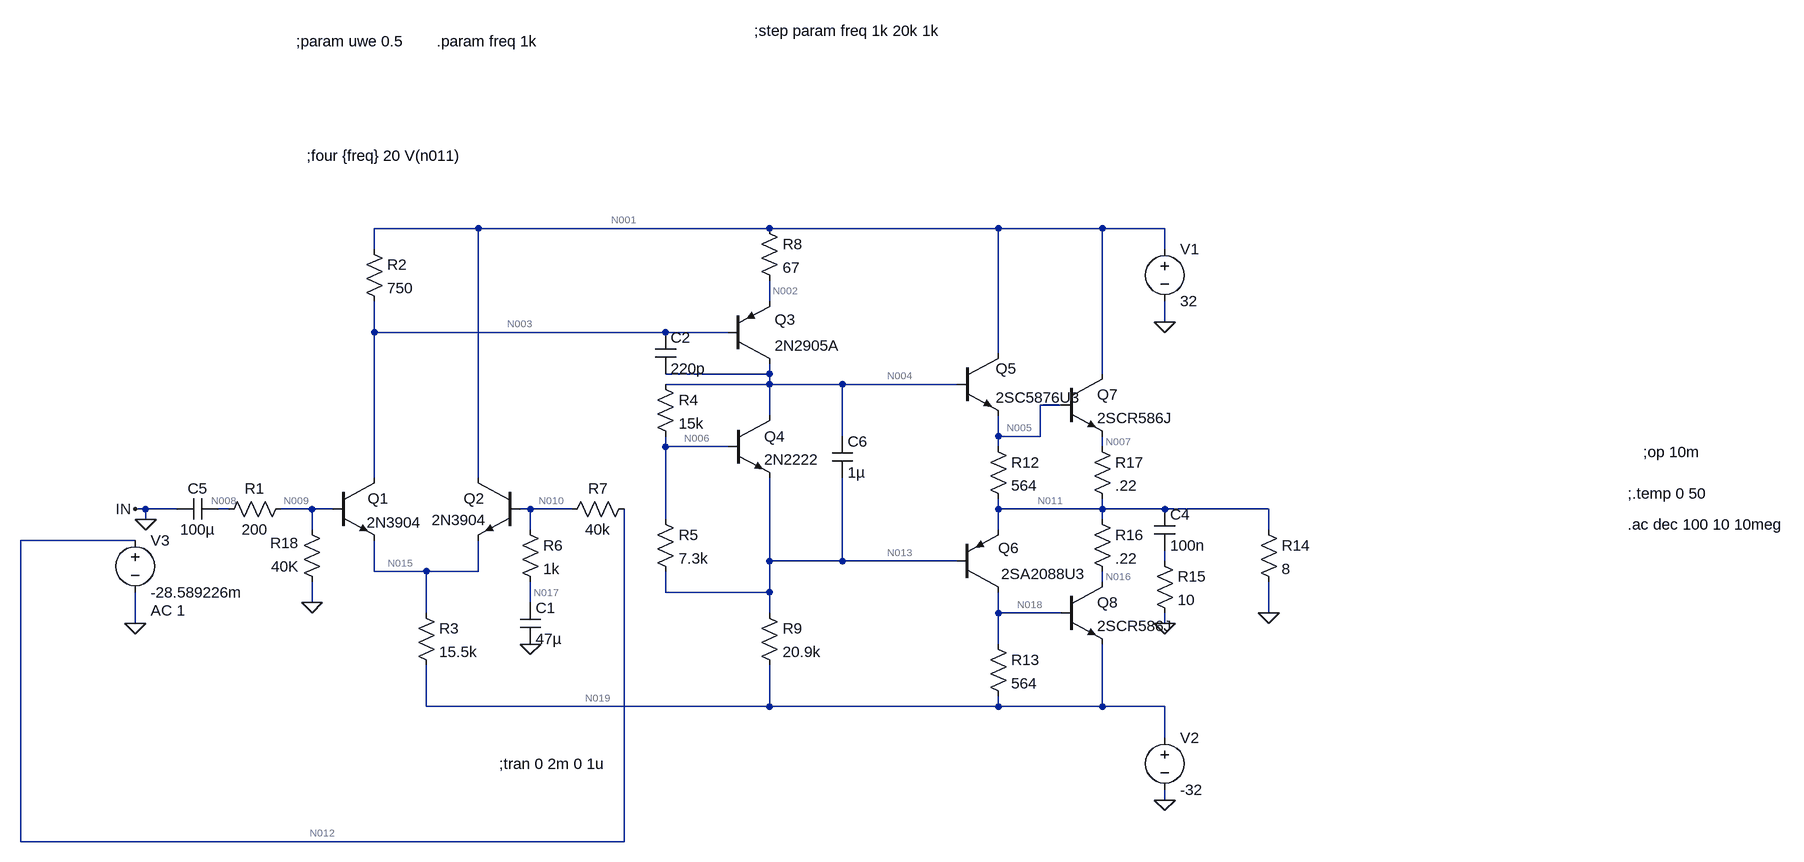
[diagram p0: schematic Wzmacniacz50W.asc]
Wzmacniacz50W.asc, the LTspice schematic file:
Version 4
SHEET 1 3112 2032
WIRE 1088 928 928 928
WIRE 1536 928 1088 928
WIRE 1888 928 1536 928
WIRE 2048 928 1888 928
WIRE 2144 928 2048 928
WIRE 928 960 928 928
WIRE 2144 960 2144 928
WIRE 1536 1040 1536 1008
WIRE 2144 1072 2144 1040
WIRE 928 1088 928 1040
WIRE 1376 1088 928 1088
WIRE 1472 1088 1376 1088
WIRE 1888 1120 1888 928
WIRE 1536 1152 1536 1136
WIRE 1536 1152 1376 1152
WIRE 2048 1152 2048 928
WIRE 1536 1168 1536 1152
WIRE 1536 1168 1376 1168
WIRE 1648 1168 1536 1168
WIRE 1824 1168 1648 1168
WIRE 1984 1200 1952 1200
WIRE 1536 1216 1536 1168
WIRE 1648 1248 1648 1168
WIRE 1888 1248 1888 1216
WIRE 1952 1248 1952 1200
WIRE 1952 1248 1888 1248
WIRE 1376 1264 1376 1248
WIRE 1472 1264 1376 1264
WIRE 1888 1264 1888 1248
WIRE 2048 1264 2048 1248
WIRE 928 1312 928 1088
WIRE 1088 1312 1088 928
WIRE 576 1360 560 1360
WIRE 624 1360 576 1360
WIRE 704 1360 688 1360
WIRE 832 1360 784 1360
WIRE 864 1360 832 1360
WIRE 1168 1360 1152 1360
WIRE 1232 1360 1168 1360
WIRE 1888 1360 1888 1344
WIRE 2048 1360 2048 1344
WIRE 2048 1360 1888 1360
WIRE 2144 1360 2048 1360
WIRE 2304 1360 2144 1360
WIRE 576 1376 576 1360
WIRE 1376 1376 1376 1264
WIRE 2048 1376 2048 1360
WIRE 832 1392 832 1360
WIRE 1168 1392 1168 1360
WIRE 1888 1392 1888 1360
WIRE 2304 1392 2304 1360
WIRE 560 1408 384 1408
WIRE 1536 1440 1536 1312
WIRE 1648 1440 1648 1312
WIRE 1648 1440 1536 1440
WIRE 1824 1440 1648 1440
WIRE 2144 1440 2144 1424
WIRE 928 1456 928 1408
WIRE 1008 1456 928 1456
WIRE 1088 1456 1088 1408
WIRE 1088 1456 1008 1456
WIRE 2048 1472 2048 1456
WIRE 1376 1488 1376 1456
WIRE 1536 1488 1536 1440
WIRE 1536 1488 1376 1488
WIRE 832 1504 832 1472
WIRE 1168 1504 1168 1472
WIRE 1008 1520 1008 1456
WIRE 1536 1520 1536 1488
WIRE 1888 1520 1888 1488
WIRE 1984 1520 1888 1520
WIRE 2304 1520 2304 1472
WIRE 560 1536 560 1488
WIRE 2144 1536 2144 1520
WIRE 1888 1568 1888 1520
WIRE 1008 1664 1008 1600
WIRE 1536 1664 1536 1600
WIRE 1536 1664 1008 1664
WIRE 1888 1664 1888 1648
WIRE 1888 1664 1536 1664
WIRE 2048 1664 2048 1568
WIRE 2048 1664 1888 1664
WIRE 2144 1664 2048 1664
WIRE 2144 1712 2144 1664
WIRE 2144 1808 2144 1792
WIRE 384 1872 384 1408
WIRE 1312 1872 1312 1360
WIRE 1312 1872 384 1872
FLAG 2144 1072 0
FLAG 2144 1808 0
FLAG 2304 1520 0
FLAG 560 1536 0
FLAG 560 1360 IN
FLAG 1168 1568 0
FLAG 2144 1536 0
FLAG 832 1504 0
FLAG 576 1376 0
DATAFLAG 1712 1168 ""
DATAFLAG 1184 1360 ""
DATAFLAG 816 1360 ""
DATAFLAG 1008 1456 ""
DATAFLAG 1312 1088 ""
DATAFLAG 1312 1088 ""
DATAFLAG 1536 1024 ""
DATAFLAG 1936 1248 ""
DATAFLAG 1936 1520 ""
DATAFLAG 1728 1440 ""
DATAFLAG 2272 1360 ""
SYMBOL NPN 1824 1120 R0
WINDOW 0 60 24 Left 2
WINDOW 3 60 68 Left 2
SYMATTR InstName Q5
SYMATTR Value 2SC5876U3
SYMBOL npn 1984 1152 R0
SYMATTR InstName Q7
SYMATTR Value 2SCR586J
SYMBOL npn 1984 1472 R0
SYMATTR InstName Q8
SYMATTR Value 2SCR586J
SYMBOL PNP 1824 1488 M180
WINDOW 0 64 68 Left 2
WINDOW 3 68 28 Left 2
SYMATTR InstName Q6
SYMATTR Value 2SA2088U3
SYMBOL VOLTAGE 2144 944 R0
WINDOW 123 0 0 Left 2
WINDOW 39 0 0 Left 2
SYMATTR InstName V1
SYMATTR Value 32
SYMBOL voltage 2144 1696 R0
WINDOW 123 0 0 Left 2
WINDOW 39 0 0 Left 2
SYMATTR InstName V2
SYMATTR Value -32
SYMBOL res 2288 1376 R0
SYMATTR InstName R14
SYMATTR Value 8
SYMBOL npn 864 1312 R0
WINDOW 0 54 32 Left 2
WINDOW 3 52 69 Left 2
SYMATTR InstName Q1
SYMATTR Value 2N3904
SYMBOL npn 1152 1312 M0
WINDOW 0 54 32 Left 2
WINDOW 3 51 65 Left 2
SYMATTR InstName Q2
SYMATTR Value 2N3904
SYMBOL res 912 944 R0
SYMATTR InstName R2
SYMATTR Value 750
SYMBOL res 992 1504 R0
SYMATTR InstName R3
SYMATTR Value 15.5k
SYMBOL pnp 1472 1136 M180
WINDOW 0 72 68 Left 2
WINDOW 3 72 28 Left 2
SYMATTR InstName Q3
SYMATTR Value 2N2905A
SYMBOL res 1152 1376 R0
SYMATTR InstName R6
SYMATTR Value 1k
SYMBOL res 1328 1344 R90
WINDOW 0 0 56 VBottom 2
WINDOW 3 32 56 VTop 2
SYMATTR InstName R7
SYMATTR Value 40k
SYMBOL voltage 560 1392 R0
WINDOW 123 24 124 Left 2
WINDOW 39 0 0 Left 2
SYMATTR Value2 AC 1
SYMATTR InstName V3
SYMATTR Value -28.589226m
SYMBOL res 800 1344 R90
WINDOW 0 0 56 VBottom 2
WINDOW 3 32 56 VTop 2
SYMATTR InstName R1
SYMATTR Value 200
SYMBOL res 1520 912 R0
SYMATTR InstName R8
SYMATTR Value 67
SYMBOL res 1872 1552 R0
SYMATTR InstName R13
SYMATTR Value 564
SYMBOL res 1872 1248 R0
SYMATTR InstName R12
SYMATTR Value 564
SYMBOL npn 1472 1216 R0
SYMATTR InstName Q4
SYMATTR Value 2N2222
SYMBOL res 1360 1152 R0
SYMATTR InstName R4
SYMATTR Value 15k
SYMBOL res 1360 1360 R0
SYMATTR InstName R5
SYMATTR Value 7.3k
SYMBOL cap 1152 1504 R0
SYMATTR InstName C1
SYMATTR Value 47µ
SYMBOL cap 2128 1360 R0
SYMATTR InstName C4
SYMATTR Value 100n
SYMBOL res 2128 1424 R0
SYMATTR InstName R15
SYMATTR Value 10
SYMBOL res 2032 1360 R0
SYMATTR InstName R16
SYMATTR Value .22
SYMBOL res 2032 1248 R0
SYMATTR InstName R17
SYMATTR Value .22
SYMBOL cap 688 1344 R90
WINDOW 0 0 32 VBottom 2
WINDOW 3 32 32 VTop 2
SYMATTR InstName C5
SYMATTR Value 100µ
SYMBOL res 848 1488 R180
WINDOW 0 36 76 Left 2
WINDOW 3 36 40 Left 2
SYMATTR InstName R18
SYMATTR Value 40K
SYMBOL cap 1632 1248 R0
SYMATTR InstName C6
SYMATTR Value 1µ
SYMBOL res 1520 1504 R0
SYMATTR InstName R9
SYMATTR Value 20.9k
SYMBOL cap 1360 1088 R0
SYMATTR InstName C2
SYMATTR Value 220p
TEXT 1120 1752 Left 2 !;tran 0 2m 0 1u
TEXT 2880 1272 Left 2 !;op 10m
TEXT 2856 1384 Left 2 !.ac dec 100 10 10meg
TEXT 2856 1336 Left 2 !;.temp 0 50
TEXT 808 640 Left 2 !;param uwe 0.5
TEXT 1024 640 Left 2 !.param freq 1k
TEXT 824 816 Left 2 !;four {freq} 20 V(n011)
TEXT 1512 624 Left 2 !;step param freq 1k 20k 1k

The netlist it stands for:
* Wzmacniacz50W.asc
Q5 N001 N004 N005 0 2SC5876U3
Q7 N001 N005 N007 0 2SCR586J
Q8 N016 N018 N019 0 2SCR586J
Q6 N018 N013 N011 0 2SA2088U3
V1 N001 0 32
V2 N019 0 -32
R14 N011 0 8
Q1 N003 N009 N015 0 2N3904
Q2 N001 N010 N015 0 2N3904
R2 N001 N003 750
R3 N015 N019 15.5k
Q3 N004 N003 N002 0 2N2905A
R6 N010 N017 1k
R7 N012 N010 40k
V3 N012 0 -28.589226m AC 1
R1 N009 N008 200
R8 N001 N002 67
R13 N018 N019 564
R12 N005 N011 564
Q4 N004 N006 N013 0 2N2222
R4 N004 N006 15k
R5 N006 N013 7.3k
C1 N017 0 47µ
C4 N011 N014 100n
R15 N014 0 10
R16 N011 N016 .22
R17 N007 N011 .22
C5 N008 0 100µ
R18 0 N009 40K
C6 N004 N013 1µ
R9 N013 N019 20.9k
C2 N003 N004 220p
.model NPN NPN
.model PNP PNP
.lib standard.bjt
;tran 0 2m 0 1u
;op 10m
.ac dec 100 10 10meg
;.temp 0 50
;param uwe 0.5
.param freq 1k
;four {freq} 20 V(n011)
;step param freq 1k 20k 1k
.backanno
.end

* Results of the author's LTspice run, read from the files saved beside the schematic
* Operating Point, zero values left out:
*   V(n001) = 32 V
*   V(n004) = 1.465 V
*   V(n005) = 842.1 mV
*   V(n007) = 143.3 mV
*   V(n016) = -200.8 mV
*   V(n018) = -31.3 V
*   V(n019) = -32 V
*   V(n013) = -665.9 mV
*   V(n011) = -28.59 mV
*   V(n003) = 31.17 V
*   V(n009) = -113.4 mV
*   V(n015) = -764.5 mV
*   V(n010) = -119.2 mV
*   V(n002) = 31.9 V
*   V(n017) = -119.2 mV
*   V(n012) = -28.59 mV
*   V(n008) = -113.4 mV
*   V(n006) = -2.188 mV
*   Ic(Q5) = 4.178 mA
*   Ib(Q5) = 13.96 µA
*   Ie(Q5) = -4.192 mA
*   Ic(Q7) = 778.7 mA
*   Ib(Q7) = 2.648 mA
*   Ie(Q7) = -781.4 mA
*   Ic(Q8) = 782.6 mA
*   Ib(Q8) = 2.663 mA
*   Ie(Q8) = -785.3 mA
*   Ic(Q6) = -3.903 mA
*   Ib(Q6) = -13.44 µA
*   Ie(Q6) = 3.916 mA
*   Ic(Q1) = 1.114 mA
*   Ib(Q1) = 2.834 µA
*   Ie(Q1) = -1.117 mA
*   Ic(Q2) = 896.3 µA
*   Ib(Q2) = 2.265 µA
*   Ie(Q2) = -898.5 µA
*   Ic(Q3) = -1.5 mA
*   Ib(Q3) = -5.434 µA
*   Ie(Q3) = 1.505 mA
*   Ic(Q4) = 1.388 mA
*   Ib(Q4) = 6.871 µA
*   Ie(Q4) = -1.395 mA
*   I(R14) = -3.574 mA
*   I(R2) = 1.108 mA
*   I(R3) = 2.015 mA
*   I(R7) = 2.265 µA
*   I(R8) = 1.505 mA
*   I(R13) = 1.239 mA
*   I(R12) = 1.544 mA
*   I(R4) = 97.79 µA
*   I(R5) = 90.92 µA
*   I(R16) = 782.6 mA
*   I(R17) = 781.4 mA
*   I(R18) = 2.834 µA
*   I(R9) = 1.499 mA
*   I(V1) = -786.4 mA
*   I(V2) = 790 mA
*   I(V3) = -2.265 µA
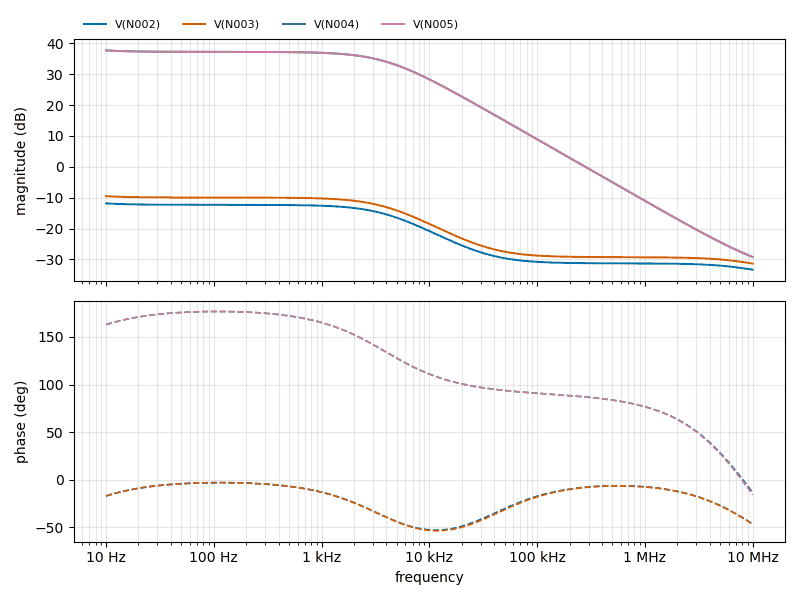
[diagram p1: AC Analysis of Wzmacniacz50W.asc, plotted from the saved traces]
* AC Analysis, 1 run:
*   V(N002): -11.86 dB at 10 Hz, -33.34 dB at 10 MHz, peak -11.86 dB at 10 Hz, 3 dB below the peak at 3.484 kHz
*   V(N003): -9.51 dB at 10 Hz, -31.35 dB at 10 MHz, peak -9.51 dB at 10 Hz, 3 dB below the peak at 3.479 kHz
*   V(N004): 37.70 dB at 10 Hz, -29.25 dB at 10 MHz, peak 37.70 dB at 10 Hz, 3 dB below the peak at 3.399 kHz
*   V(N005): 37.69 dB at 10 Hz, -29.20 dB at 10 MHz, peak 37.69 dB at 10 Hz, 3 dB below the peak at 3.402 kHz